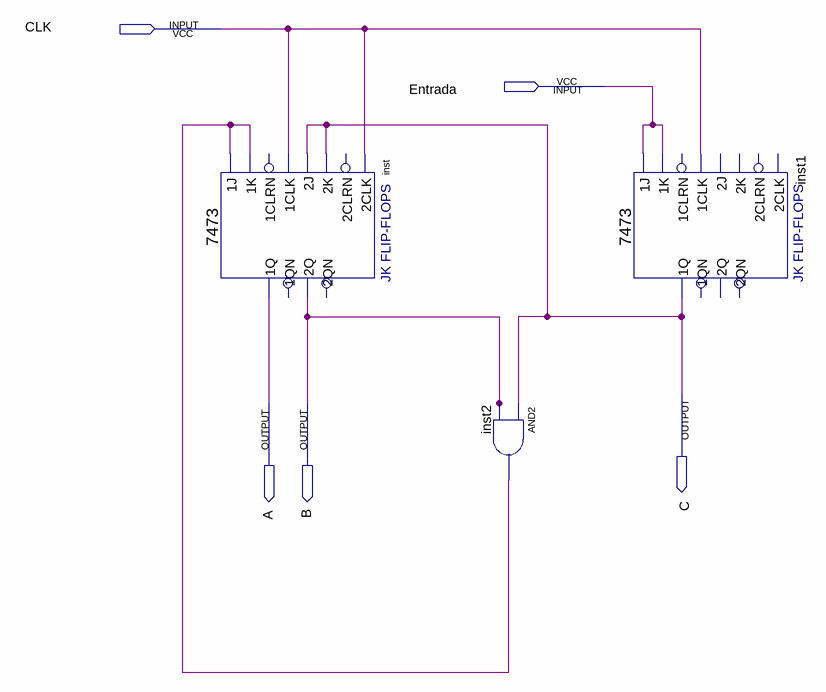
[diagram p0: schematic sheet]
// Quartus schematic contador.bdf as structural Verilog: 3 symbols, 5 pins
module contador (
  input  CLK,
  input  Entrada,
  output C,
  output A,
  output B
);

  wire inst2_out;

  \7473  inst (
    .\1J (inst2_out), .\1K (inst2_out), .\1CLK (CLK), .\2J (C), .\2CLK (CLK), .\2K (C), .\2Q (B), .\1Q (A));  // open: 1CLRN, 2CLRN, 1QN, 2QN
  and inst2 (inst2_out, C, B);
  \7473  inst1 (
    .\1J (Entrada), .\1K (Entrada), .\1CLK (CLK), .\1Q (C));  // open: 1CLRN, 2J, 2CLK, 2CLRN, 2K, 1QN, 2Q, 2QN
endmodule
